# Altium schematic sheet microcontroller3.SchDoc
size Tabloid
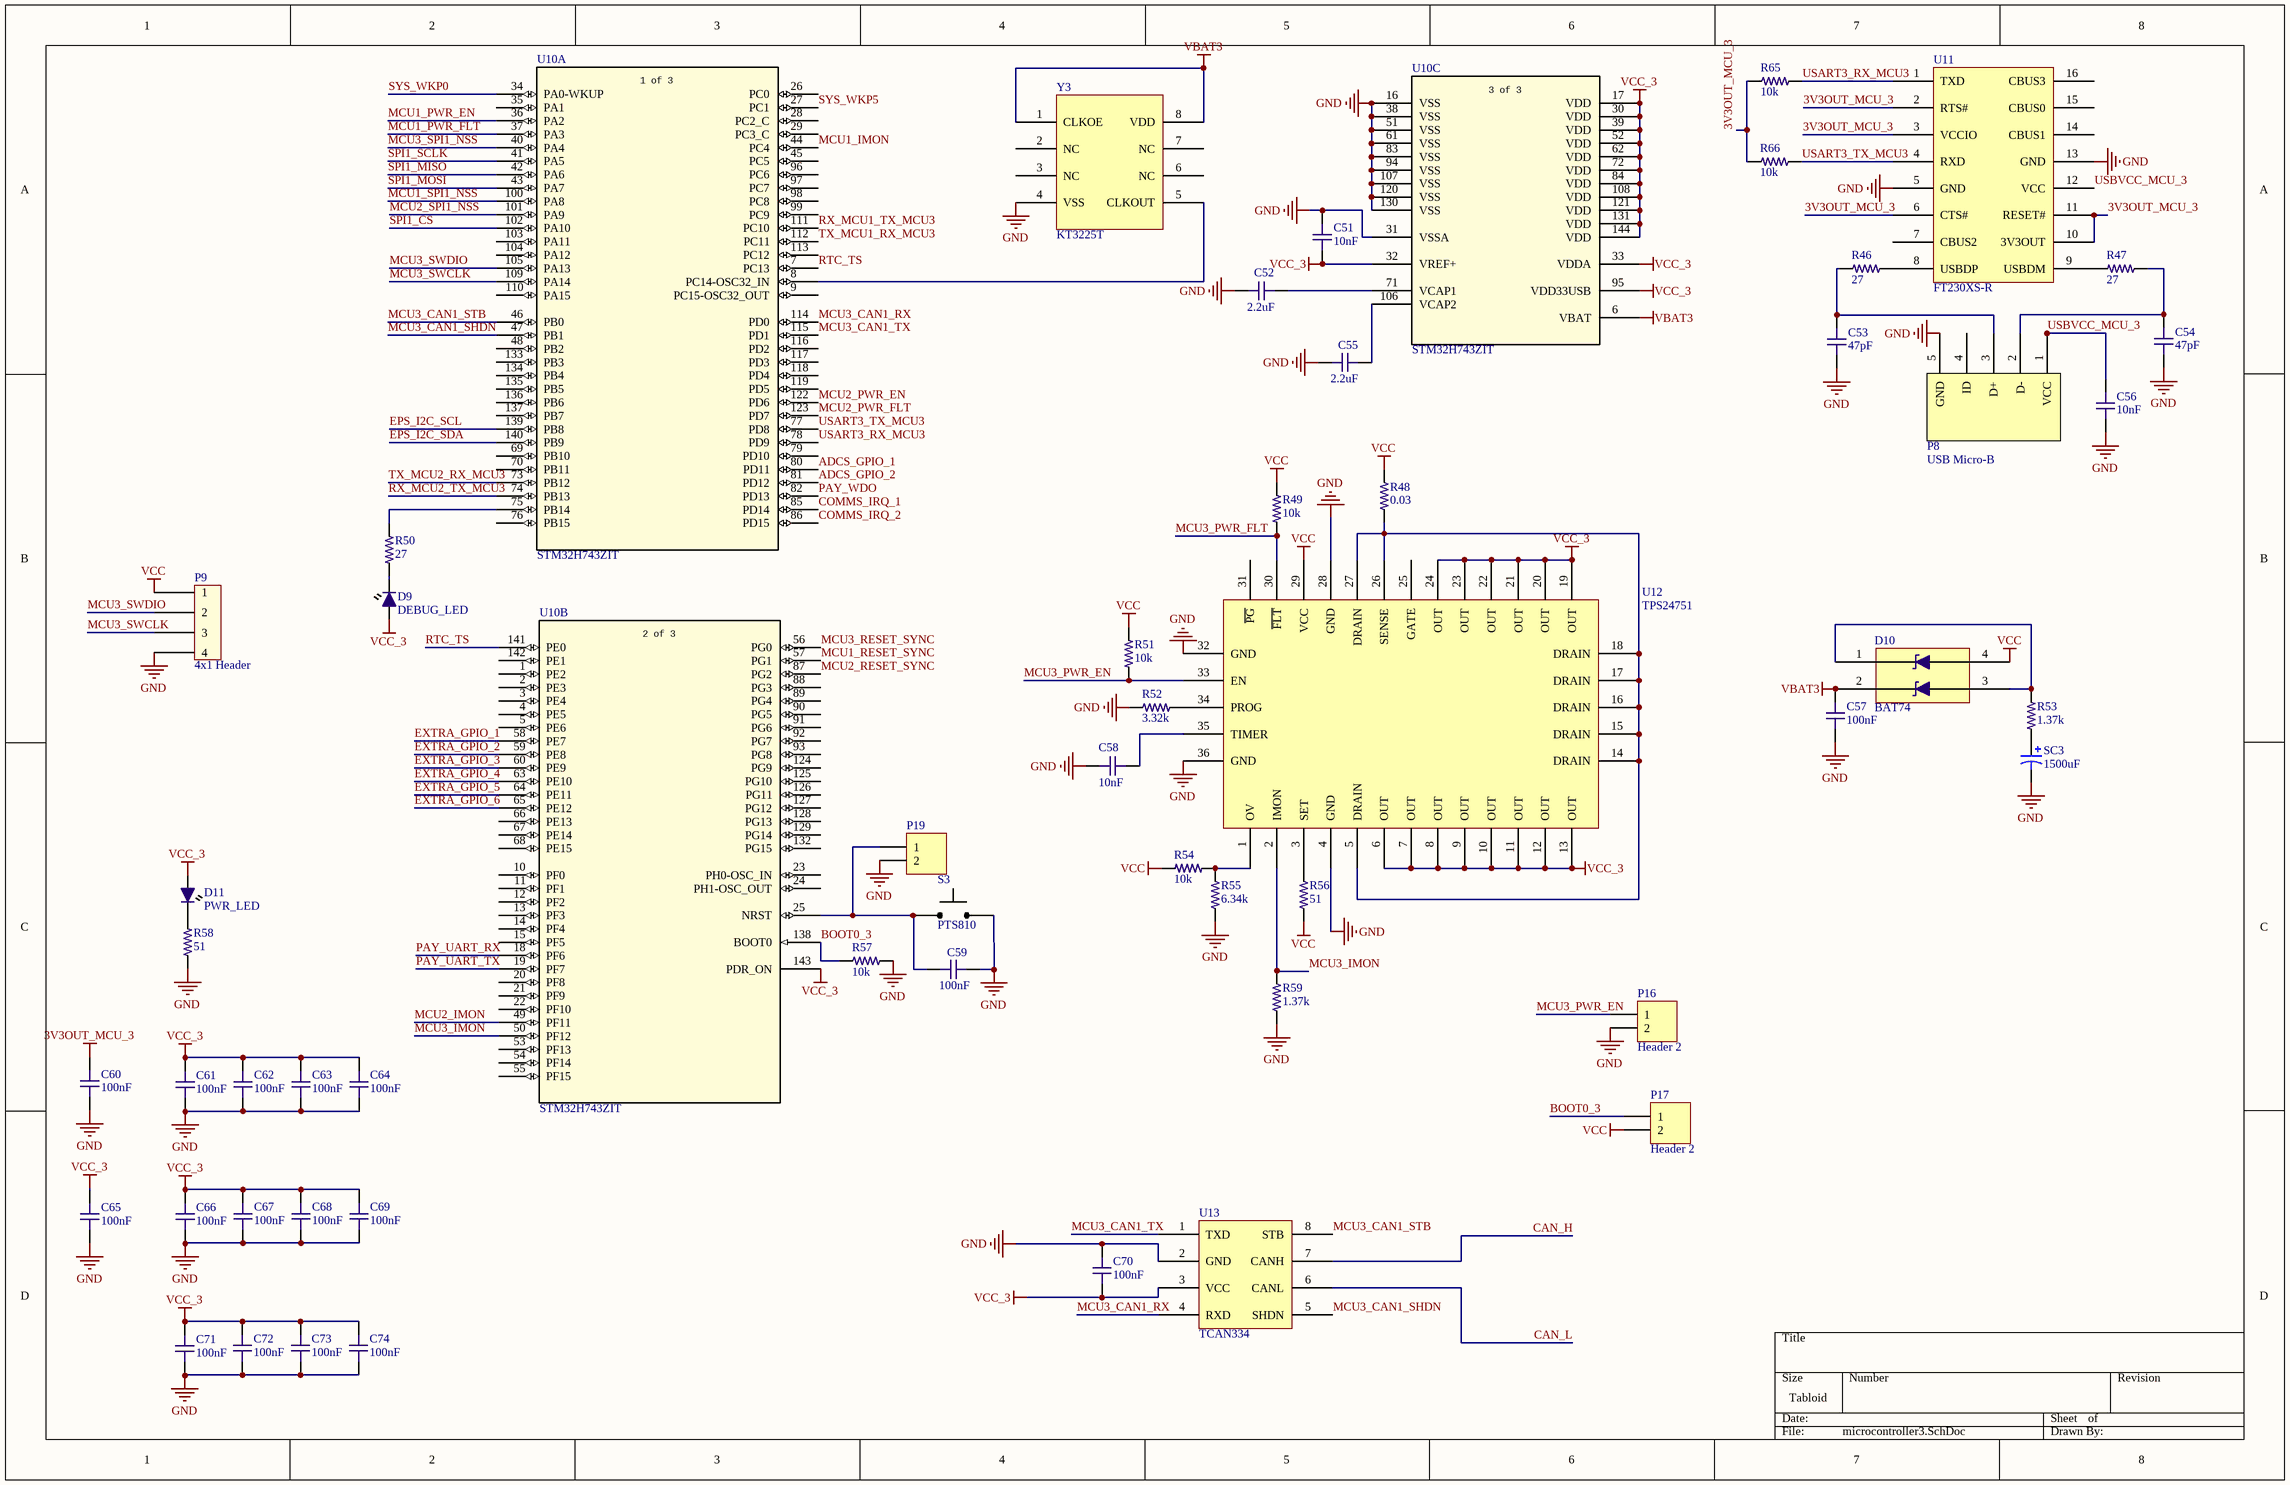
[diagram p0: microcontroller3.SchDoc]

## Parts
C51  value 10nF  [C0603-IPC]  (hidden comment: 0603 Capacitor Template)
C52  value 2.2uF  [C0603-IPC]  (hidden comment: 0603 Capacitor Template)
C53  value 47pF  [C0603-IPC]  (hidden comment: 0603 Capacitor Template)
C54  value 47pF  [C0603-IPC]  (hidden comment: 0603 Capacitor Template)
C55  value 2.2uF  [C0603-IPC]  (hidden comment: 0603 Capacitor Template)
C56  value 10nF  [C0603-IPC]  (hidden comment: 0603 Capacitor Template)
C57  value 100nF  [C0603-IPC]  (hidden comment: 0603 Capacitor Template)
C58  value 10nF  [C0603-IPC]  (hidden comment: 0603 Capacitor Template)
C59  value 100nF  [C0603-IPC]  (hidden comment: 0603 Capacitor Template)
C60  value 100nF  [C0603-IPC]  (hidden comment: 0603 Capacitor Template)
C61  value 100nF  [C0603-IPC]  (hidden comment: 0603 Capacitor Template)
C62  value 100nF  [C0603-IPC]  (hidden comment: 0603 Capacitor Template)
C63  value 100nF  [C0603-IPC]  (hidden comment: 0603 Capacitor Template)
C64  value 100nF  [C0603-IPC]  (hidden comment: 0603 Capacitor Template)
C65  value 100nF  [C0603-IPC]  (hidden comment: 0603 Capacitor Template)
C66  value 100nF  [C0603-IPC]  (hidden comment: 0603 Capacitor Template)
C67  value 100nF  [C0603-IPC]  (hidden comment: 0603 Capacitor Template)
C68  value 100nF  [C0603-IPC]  (hidden comment: 0603 Capacitor Template)
C69  value 100nF  [C0603-IPC]  (hidden comment: 0603 Capacitor Template)
C70  value 100nF  [C0603-IPC]  (hidden comment: 0603 Capacitor Template)
C71  value 100nF  [C0603-IPC]  (hidden comment: 0603 Capacitor Template)
C72  value 100nF  [C0603-IPC]  (hidden comment: 0603 Capacitor Template)
C73  value 100nF  [C0603-IPC]  (hidden comment: 0603 Capacitor Template)
C74  value 100nF  [C0603-IPC]  (hidden comment: 0603 Capacitor Template)
D9  DEBUG_LED  [LED0603-IPC]
D10  BAT74  [SOT190P230X110-4N]
D11  PWR_LED  [LED0603-IPC]
P8  USB Micro-B  [Micro USB B]
P9  4x1 Header  [4X1 HEADER]
P16  Header 2  [HDR1X2]
P17  Header 2  [HDR1X2]
P19  Header 2  [HDR1X2]  (value not drawn)
R46  value 27  [R0603-IPC]  (hidden comment: 0603 Template)
R47  value 27  [R0603-IPC]  (hidden comment: 0603 Template)
R48  value 0.03  [R2512-IPC]  (hidden comment: 2512 Template)
R49  value 10k  [R0603-IPC]  (hidden comment: 0603 Template)
R50  value 27  [R0603-IPC]  (hidden comment: 0603 Template)
R51  value 10k  [R0603-IPC]  (hidden comment: 0603 Template)
R52  value 3.32k  [R0603-IPC]  (hidden comment: 0603 Template)
R53  value 1.37k  [R0603-IPC]  (hidden comment: 2512 Template)
R54  value 10k  [R0603-IPC]  (hidden comment: 0603 Template)
R55  value 6.34k  [R0603-IPC]  (hidden comment: 0603 Template)
R56  value 51  [R0603-IPC]  (hidden comment: 0603 Template)
R57  value 10k  [R0603-IPC]  (hidden comment: 0603 Template)
R58  value 51  [R0603-IPC]  (hidden comment: 0603 Template)
R59  value 1.37k  [R0603-IPC]  (hidden comment: 0603 Template)
R65  value 10k  [R0603-IPC]  (hidden comment: 0603 Template)
R66  value 10k  [R0603-IPC]  (hidden comment: 0603 Template)
S3  PTS810  [PTS810]
SC3  value 1500uF  [C7360-IPC]  (hidden comment: Cap Pol1)
U10  STM32H743ZIT  [LQFP50P2200X2200X160-144N]  (parts A,B,C of 3)
U11  FT230XS-R  [SOP64P600X175-16N]
U12  TPS24751  [VQFN50P700X350X100-36N]
U13  TCAN334  [SOIC127P600X175-8N]
Y3  KT3225T  [KT3225T XTAL]

## Nets
3V3OUT_MCU_3: C60.2 R65.1 R66.1 U11.2(RTS#) U11.3(VCCIO) U11.6(CTS#) U11.10(3V3OUT) U11.11(RESET#)
GND: C51.2 C52.1 C53.1 C54.1 C55.1 C56.1 C57.1 C58.1 C59.2 C60.1 C61.1 C62.1 C63.1 C64.1 C65.1 C66.1 C67.1 C68.1 C69.1 C70.2 C71.1 C72.1 C73.1 C74.1 P8.5(GND) P9.4 P16.2 P19.2 R52.1 R55.1 R57.1 R58.2 R59.1 S3.2 SC3.2 U10.16(VSS) U10.31(VSSA) U10.38(VSS) U10.51(VSS) U10.61(VSS) U10.83(VSS) U10.94(VSS) U10.107(VSS) U10.120(VSS) U10.130(VSS) U11.5(GND) U11.13(GND) U12.4(GND) U12.28(GND) U12.32(GND) U12.36(GND) U13.2(GND) Y3.4(VSS)
VBAT3: C57.2 D10.2 U10.6(VBAT) Y3.1(CLKOE) Y3.8(VDD)
VCC: D10.4 P9.1 P17.2 R48.1 R49.2 R51.2 R54.1 R56.1 U12.29(VCC)
VCC_3: C51.1 C61.2 C62.2 C63.2 C64.2 C65.2 C66.2 C67.2 C68.2 C69.2 C70.1 C71.2 C72.2 C73.2 C74.2 D9.A D11.A U10.17(VDD) U10.30(VDD) U10.32(VREF+) U10.33(VDDA) U10.39(VDD) U10.52(VDD) U10.62(VDD) U10.72(VDD) U10.84(VDD) U10.95(VDD33USB) U10.108(VDD) U10.121(VDD) U10.131(VDD) U10.143(PDR_ON) U10.144(VDD) U12.6(OUT) U12.7(OUT) U12.8(OUT) U12.9(OUT) U12.10(OUT) U12.11(OUT) U12.12(OUT) U12.13(OUT) U12.19(OUT) U12.20(OUT) U12.21(OUT) U12.22(OUT) U12.23(OUT) U12.24(OUT) U13.3(VCC)
ADCS_GPIO_1: U10.80(PD11)
ADCS_GPIO_2: U10.81(PD12)
BOOT0_3: P17.1 R57.2 U10.138(BOOT0)
CAN_H: U13.7(CANH)
CAN_L: U13.6(CANL)
COMMS_IRQ_1: U10.85(PD14)
COMMS_IRQ_2: U10.86(PD15)
EPS_I2C_SCL: U10.139(PB8)
EPS_I2C_SDA: U10.140(PB9)
EXTRA_GPIO_1: U10.58(PE7)
EXTRA_GPIO_2: U10.59(PE8)
EXTRA_GPIO_3: U10.60(PE9)
EXTRA_GPIO_4: U10.63(PE10)
EXTRA_GPIO_5: U10.64(PE11)
EXTRA_GPIO_6: U10.65(PE12)
MCU1_IMON: U10.44(PC4)
MCU1_PWR_EN: U10.36(PA2)
MCU1_PWR_FLT: U10.37(PA3)
MCU1_RESET_SYNC: U10.57(PG1)
MCU1_SPI1_NSS: U10.100(PA8)
MCU2_IMON: U10.49(PF11)
MCU2_PWR_EN: U10.122(PD6)
MCU2_PWR_FLT: U10.123(PD7)
MCU2_RESET_SYNC: U10.87(PG2)
MCU2_SPI1_NSS: U10.101(PA9)
MCU3_CAN1_RX: U10.114(PD0) U13.4(RXD)
MCU3_CAN1_SHDN: U10.47(PB1) U13.5(SHDN)
MCU3_CAN1_STB: U10.46(PB0) U13.8(STB)
MCU3_CAN1_TX: U10.115(PD1) U13.1(TXD)
MCU3_IMON: R59.2 U10.50(PF12) U12.2(IMON)
MCU3_PWR_EN: P16.1 R51.1 U12.33(EN)
MCU3_PWR_FLT: R49.1 U12.30(~{FLT})
MCU3_RESET_SYNC: U10.56(PG0)
MCU3_SPI1_NSS: U10.40(PA4)
MCU3_SWCLK: P9.3 U10.109(PA14)
MCU3_SWDIO: P9.2 U10.105(PA13)
PAY_UART_RX: U10.18(PF6)
PAY_UART_TX: U10.19(PF7)
PAY_WDO: U10.82(PD13)
RTC_TS: U10.7(PC13) U10.141(PE0)
RX_MCU1_TX_MCU3: U10.111(PC10)
RX_MCU2_TX_MCU3: U10.74(PB13)
SPI1_CS: U10.102(PA10)
SPI1_MISO: U10.42(PA6)
SPI1_MOSI: U10.43(PA7)
SPI1_SCLK: U10.41(PA5)
SYS_WKP0: U10.34(PA0-WKUP)
SYS_WKP5: U10.27(PC1)
TX_MCU1_RX_MCU3: U10.112(PC11)
TX_MCU2_RX_MCU3: U10.73(PB12)
USART3_RX_MCU3: R65.2 U10.78(PD9) U11.1(TXD)
USART3_TX_MCU3: R66.2 U10.77(PD8) U11.4(RXD)
USBVCC_MCU_3: C56.2 P8.1(VCC) U11.12(VCC)
NetC52_2: C52.2 U10.71(VCAP1)
NetC53_2: C53.2 P8.3(D+) R46.1
NetC54_2: C54.2 P8.2(D-) R47.2
NetC55_2: C55.2 U10.106(VCAP2)
NetC58_2: C58.2 U12.35(TIMER)
NetC59_1: C59.1 P19.1 S3.1 U10.25(NRST)
NetD9_K: D9.K R50.1
NetD10_1: D10.1 D10.3 R53.2
NetD11_K: D11.K R58.1
NetR46_2: R46.2 U11.8(USBDP)
NetR47_1: R47.1 U11.9(USBDM)
NetR48_2: R48.2 U12.5(DRAIN) U12.14(DRAIN) U12.15(DRAIN) U12.16(DRAIN) U12.17(DRAIN) U12.18(DRAIN) U12.26(SENSE) U12.27(DRAIN)
NetR50_2: R50.2 U10.75(PB14)
NetR52_2: R52.2 U12.34(PROG)
NetR53_1: R53.1 SC3.1
NetR54_2: R54.2 R55.2 U12.1(OV)
NetR56_2: R56.2 U12.3(SET)
NetU10_8: U10.8(PC14-OSC32_IN) Y3.5(CLKOUT)

Not connected (* = marked no-connect by the designer): P8 4(ID); U10 1(PE2) 2(PE3) 3(PE4) 4(PE5) 5(PE6) 9(PC15-OSC32_OUT) 10(PF0) 11(PF1) 12(PF2) 13(PF3) 14(PF4) 15(PF5) 20(PF8) 21(PF9) 22(PF10) 23(PH0-OSC_IN) 24(PH1-OSC_OUT) 26(PC0) 28(PC2_C) 29(PC3_C) 35(PA1) 45(PC5) 48(PB2) 53(PF13) 54(PF14) 55(PF15) 66(PE13) 67(PE14) 68(PE15) 69(PB10) 70(PB11) 76(PB15) 79(PD10) 88(PG3) 89(PG4) 90(PG5) 91(PG6) 92(PG7) 93(PG8) 96(PC6) 97(PC7) 98(PC8) 99(PC9) 103(PA11) 104(PA12) 110(PA15) 113(PC12) 116(PD2) 117(PD3) 118(PD4) 119(PD5) 124(PG9) 125(PG10) 126(PG11) 127(PG12) 128(PG13) 129(PG14) 132(PG15) 133(PB3) 134(PB4) 135(PB5) 136(PB6) 137(PB7) 142(PE1); U11 7(CBUS2) 14(CBUS1) 15(CBUS0) 16(CBUS3); U12 25(GATE) 31(~{PG}); Y3 2(NC) 3(NC) 6(NC) 7(NC)

## Notes on the sheet
- (in symbol STM32H743ZIT, part A) 1 of 3
- (in symbol STM32H743ZIT, part B) 2 of 3
- (in symbol STM32H743ZIT, part C) 3 of 3

## Library data of the parts
C51-C74 = 0603 Capacitor Template: Chip Capacitor, 0603, ??nF, 10V, X7R; EIA Code: X7R; Max. Voltage: 10V
D9 = LED 0603 SMD: Blue DEBUG_LED; Supplier 1: Digi-Key; Supplier Part Number 1: 732-4966-1-ND
D10 = BAT74: Barrier Schotkky Double Diode; Supplier 1: Digi-Key; Supplier Part Number 1: 1727-2906-1-ND
D11 = LED 0603 SMD: Red PWR_LED; Supplier 1: Digi-Key; Supplier Part Number 1: 732-4966-1-ND
P8 = USB Micro-B: CONN RCPT USB TYPE B 3A; Manufacturer Part Number: 629105150521; Manufacturer: Wurth Electronics Inc.; Supplier 1: Digi-Key; Supplier Part Number 1: 609-4616-1-ND
P16 P17 P19 = Header 2: Header, 2-Pin; LatestRevisionDate: 17-Jul-2002; LatestRevisionNote: Re-released for DXP Platform.; Publisher: Altium Limited
R46 R47 R49-R52 R54-R59 R65 R66 = 0603 Template: Chip Resistor, 0603, ??k ohms, 0.1W
R48 R53 = 2512 Template: Chip Resistor, 2515, ??k ohms
S3 = PTS810: SWITCH TACTILE 0.05A 16V; Supplier 1: Digi-Key; Supplier Part Number 1: CKN10502CT-ND
SC3 = Cap Pol1: Polarized Capacitor (Radial); Published: 8-Jun-2000; LatestRevisionDate: 17-Jul-2002; LatestRevisionNote: Re-released for DXP Platform.; PackageReference: RB7.6-15; Publisher: Altium Limited; PackageDescription: Polarized Capacitor (Radial); 2 Leads
U10 = STM32H743ZIT: IC MCU STM32H7; Supplier 1: Digi-Key; Supplier Part Number 1: 497-17721-ND
U11 = FT230XS-R: FTDI USB to UART IC; Supplier 1: Digi-Key; Supplier Part Number 1: 768-1135-1-ND
U12 = TPS24751: eFuse Circuit Protector with Current Monitor; Supplier 1: Digi-Key; Supplier Part Number 1: 296-37084-1-ND
U13 = TCAN334: 3V3 CAN Transceiver; Supplier 1: Digi-Key; Supplier Part Number 1: 296-44503-1-ND
Y3 = KT3225T: Temperate Compensated Crystal Oscillator; Supplier 1: Digi-Key; Supplier Part Number 1: 1253-1030-1-ND